# EAGLE design ONET1191P-breakout (EAGLE 9.4.1)
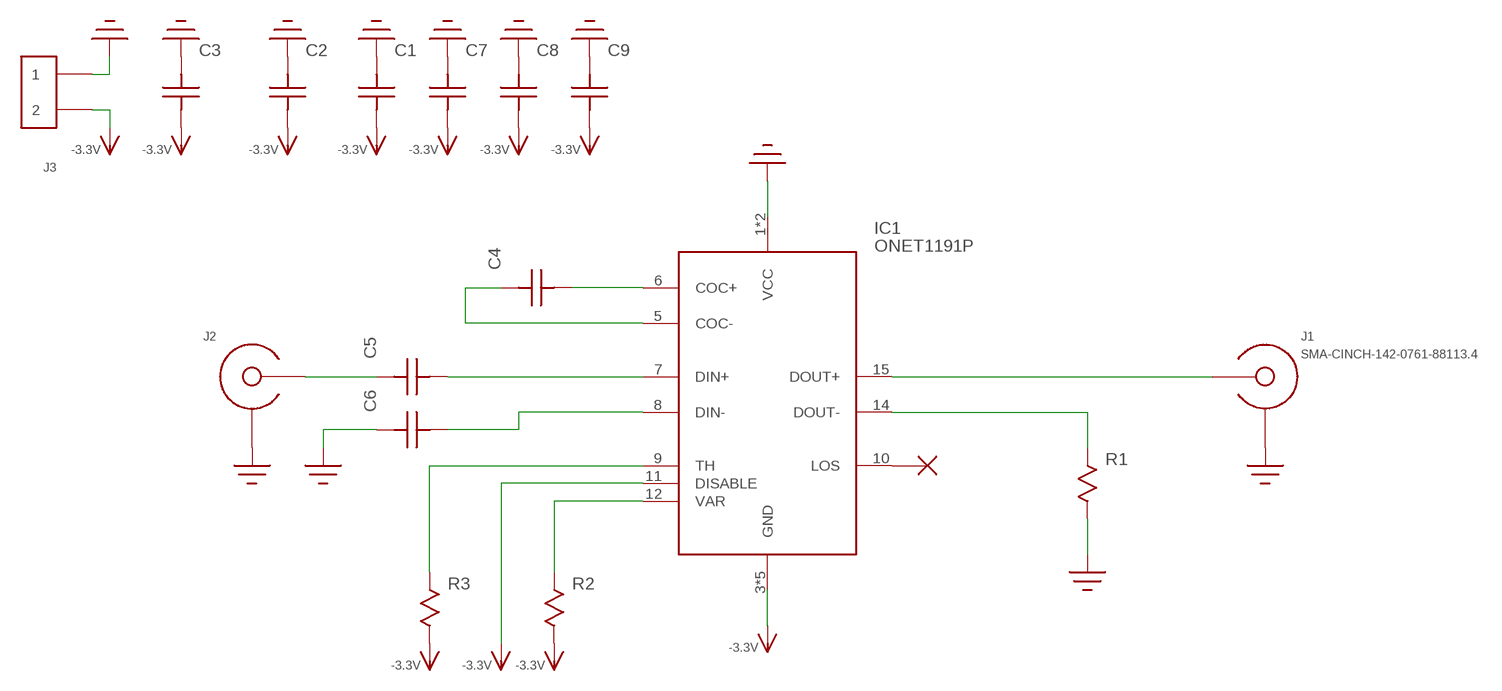
[diagram p0: schematic, sheet 1]

## Parts
C1  C0603  [C0603]
C2  C0603  [C0603]
C3  C1206  [1206]
C4  C  [C0402]
C5  C  [C0402]
C6  C  [C0402]
C7  C  [C0402]
C8  C  [C0402]
C9  C  [C0402]
IC1  ONET1191P  [TQFN16]
J1  SMA-CINCH-142-0761-88113.4  [SMA-CINCH-142-0761-881-13.4]
J2  SMA-EDGE-LAUNCH4L-4020-TAPER-FIXED  [SMA_EDGE_LAUNCH_4L_4020_TAPER_FIXED]
J3  HEADER_2PIN  [HEADER_2PIN]
R1  R0402  [0402]
R2  R0603  [R0603]
R3  R0603  [R0603]
U$8  NO_CONNECT  (no package)

## Nets
-3.3V: C1.P$1 C2.P$1 C3.P$1 C7.1 C8.1 C9.1 IC1.3(GND) IC1.4(GND) IC1.11(DISABLE) IC1.13(GND) IC1.16(GND) IC1.EP(GND) J3.2 R2.P$2 R3.P$2
GND: C1.P$2 C2.P$2 C3.P$2 C6.2 C7.2 C8.2 C9.2 IC1.1(VCC) IC1.2(VCC) J1.GND@1(SHIELD) J1.GND@2(SHIELD) J1.GND@3(SHIELD) J1.HOLE@1(SHIELD) J1.HOLE@2(SHIELD) J1.HOLE@3(SHIELD) J1.HOLE@4(SHIELD) J1.VIA@1(SHIELD) J1.VIA@2(SHIELD) J1.VIA@3(SHIELD) J1.VIA@4(SHIELD) J1.VIA@5(SHIELD) J1.VIA@6(SHIELD) J2.BOTTOM_GND(SHIELD) J2.GND@1(SHIELD) J2.GND@2(SHIELD) J2.GND@3(SHIELD) J2.GND@4(SHIELD) J2.GND@5(SHIELD) J2.GND@6(SHIELD) J2.GND@7(SHIELD) J2.GND@8(SHIELD) J2.GND@14(SHIELD) J2.GND@15(SHIELD) J2.GND@16(SHIELD) J2.GND@17(SHIELD) J2.GND_PAD1(SHIELD) J2.GND_PAD2(SHIELD) J2.P$1(SHIELD) J2.P$2(SHIELD) J3.1 R1.2
N$1: C4.1 IC1.6(COC+)
N$2: C4.2 IC1.5(COC-)
N$3: IC1.14(DOUT-) R1.1
N$4 [13.4-6]: IC1.15(DOUT+) J1.CENTER
N$5: IC1.12(VAR) R2.P$1
N$6: IC1.9(TH) R3.P$1
N$7: IC1.10(LOS) U$8.P$1
N$9 [13.4-6]: C5.2 J2.CENTER@1(CENTER) J2.P$3(CENTER)
N$10: C5.1 IC1.7(DIN+)
N$11: C6.1 IC1.8(DIN-)

## Library data of the parts
C1-C9 = yapo:C
IC1 = yapo:ONET1191P
J1 = yapo:SMA-CINCH-142-0761-881
J2 = yapo:SMA-EDGE-LAUNCH
J3 = yapo:HEADER_2PIN
R1-R3 = yapo:R
U$8 = yapo:NO_CONNECT

## Net classes
1 13.4-6: width 0.34 mm, clearance 0.152 mm

## Board
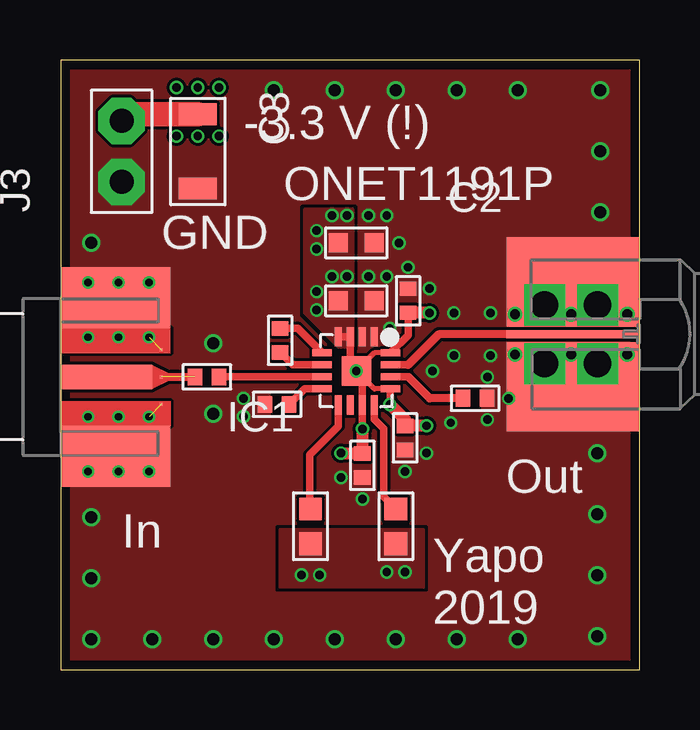
[diagram p1: board, top side]
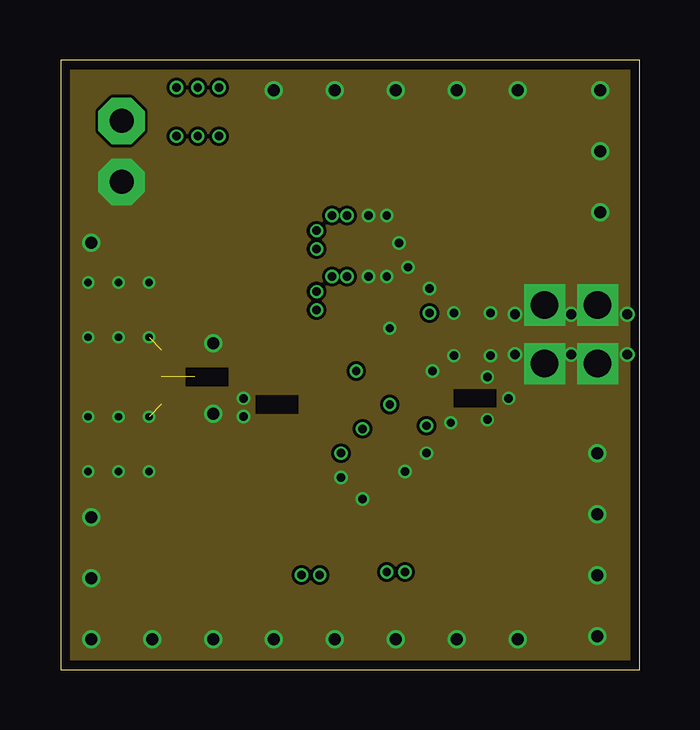
[diagram p2: board, inner layer Route2]
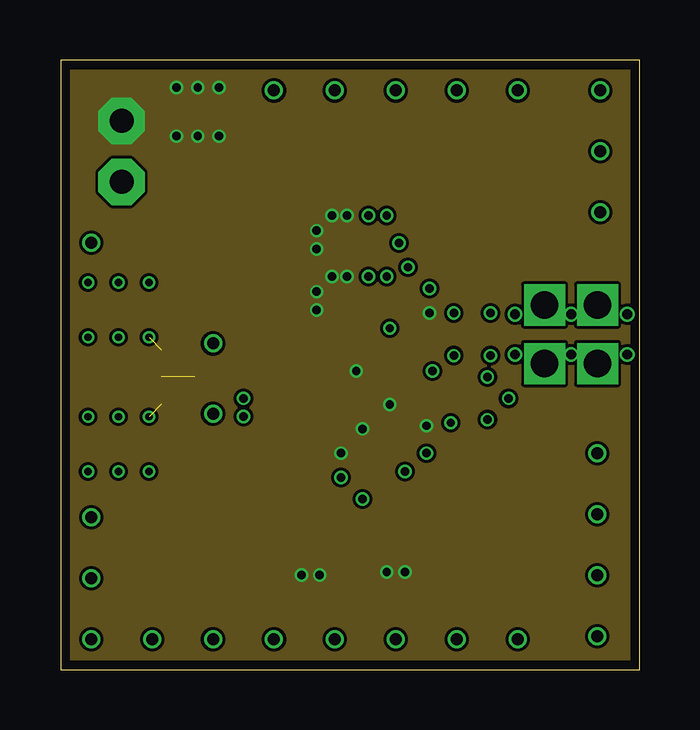
[diagram p3: board, inner layer Route15]
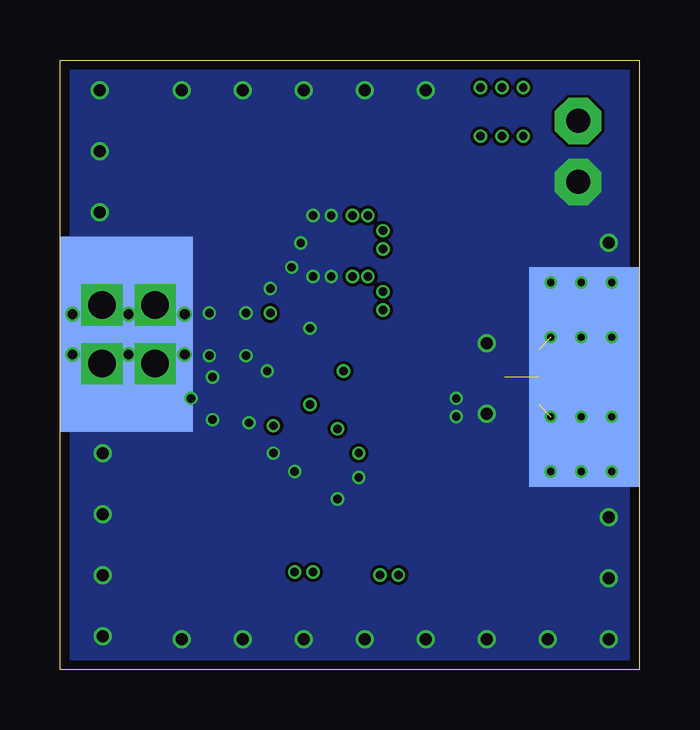
[diagram p4: board, bottom side, seen from below]

Size 24.13 x 25.4 mm. Coordinates in mm from the lower left corner, seen from the top.
Outline: 0,0 24.13,0 24.13,25.4 0,25.4 0,0
Copper layers (1*2*15*16): Top 0.035559375mm / dielectric 0.17018125mm / Route2 0.01778125mm / dielectric 47mil / Route15 0.01778125mm / dielectric 0.17018125mm / Bottom 0.035559375mm
Design rules "oshpark-4layer *": minimum track width 5mil, minimum drill 10mil, track to track 5mil, track to pad 5mil, pad to pad 5mil, via to via 5mil, smd to smd 5mil, copper to edge 15mil, drill to drill 6mil, minimum pad ring 4mil, minimum via ring 4mil, stop-mask expansion 2.5mil, vias tented up to drill 20mil, thermal gap 10mil

### Footprints (pad centres in the part's own frame; a part is rotated, then mirrored left to right if it is on the bottom)
C0603 = smd 0.8 x 0.8: P$1 -0.75,0; P$2 0.75,0
1206 = smd 0.9 x 1.6: P$1 -1.55,0; P$2 1.55,0
C0402 = smd 0.6 x 0.7: 1 -0.5,0; 2 0.5,0
TQFN16 = smd 0.3 x 0.8: 1 -0.75,-1.425; 2 -0.25,-1.425; 3 0.25,-1.425; 4 0.75,-1.425; 9 0.75,1.425; 10 0.25,1.425; 11 -0.25,1.425; 12 -0.75,1.425 | smd 0.8 x 0.3: 5 1.425,-0.75; 6 1.425,-0.25; 7 1.425,0.25; 8 1.425,0.75; 13 -1.425,0.75; 14 -1.425,0.25; 15 -1.425,-0.25; 16 -1.425,-0.75 | smd 1.23 x 1.23: EP 0,0
SMA-CINCH-142-0761-881-13.4 = smd 0.34 x 5.537: CENTER 0,-2.794 | smd 3.724 x 5.537: GND@1 -2.184,-2.769; GND@2 2.184,-2.769 | smd 8.128 x 5.537 bottom: GND@3 0,-2.769 | drill 1.143 pad 1.422 square: HOLE@1 -1.219,-3.962; HOLE@2 1.219,-3.962; HOLE@3 1.219,-1.753; HOLE@4 -1.219,-1.753 | drill 0.406 pad 0.61: VIA@1 -0.838,-5.194; VIA@2 0.838,-5.194; VIA@3 0.838,-2.857; VIA@4 0.838,-0.521; VIA@5 -0.838,-0.521; VIA@6 -0.838,-2.857
SMA_EDGE_LAUNCH_4L_4020_TAPER_FIXED = smd 4.572 x 9.144 bottom: BOTTOM_GND 2.286,0 | smd 3.81 x 1.016: CENTER@1 1.905,0 | drill 0.3: GND@1 1.143,3.937; GND@2 3.683,3.937; GND@3 1.143,1.651; GND@4 3.683,1.651; GND@5 1.143,-1.651; GND@6 3.683,-1.651; GND@7 1.143,-3.937; GND@8 3.683,-3.937; GND@14 2.413,3.937; GND@15 2.413,-3.937; GND@16 2.413,-1.651; GND@17 2.413,1.651 | smd 4.572 x 2.54: GND_PAD1 2.286,3.302; GND_PAD2 2.286,-3.302 | smd 0.127 x 0.127: P$1 4.191,1.143; P$2 4.191,-1.143; P$3 4.191,0
HEADER_2PIN = drill 1 pad 1.93 octagon: 1 -1.27,0; 2 1.27,0
0402 = smd 0.6 x 0.7: 1 -0.5,0; 2 0.5,0
R0603 = smd 0.95 x 0.95: P$1 -0.725,0; P$2 0.725,0

### Placement (x,y rotation side)
C1  12.32,15.37 0 top
C2  12.32,17.78 0 top
C3  5.71,21.59 270 top
C4  9.14,13.72 90 top
C5  6.1,12.19 180 top
C6  9.02,11.05 180 top
C7  14.35,9.65 270 top
C8  14.48,15.37 90 top
C9  12.57,8.51 270 top
IC1  12.32,12.45 180 top
J1  24.13,13.97 270 top
J2  0,12.19 0 top
J3  2.54,21.59 90 top
R1  17.27,11.3 0 top
R2  13.97,5.97 270 top
R3  10.41,5.97 270 top

### Tracks (layer width: path | path; a pad name or v marks a point on that pad's centre or on a via)
-3.3V  (via drill 0.35)
  Top 0.203: IC1.16 13.07,13.2 IC1.EP | IC1.13 13.07,11.7 12.57,12.2
  Top 0.305: v12.57,10.03 v12.57,10.04 IC1.11 12.57,12.2 IC1.EP 12.07,12.7 IC1.3 IC1.4 | v13.72,11.05 13.74,11.08 IC1.13 | IC1.16 14.48,13.93 C8.1
  Top 0.508: v12.57,10.03 C9.1 v11.68,9.02 | v13.72,11.05 14.35,10.41 C7.1 v15.23,10.15 v15.24,10.16 | v15.37,14.86 C8.1
  Top 1.016: J3.2 2.54,23.14 C3.P$1
  other vias: 12.32,12.45 10.03,3.94 10.79,3.94 13.59,4.06 14.35,4.06 10.67,15.75 10.67,14.99 11.3,16.38 11.94,16.38 11.3,18.92 11.94,18.92 10.67,18.29 10.67,17.53 5.71,22.23 6.6,22.23 4.83,22.23 5.71,24.26 6.6,24.26 4.83,24.26
  pour Top (no thermals): 12.19,13.46 12.19,19.18 10.16,19.18 10.16,14.86 11.56,13.46
  pour Route15 (no thermals): 0,0 0,25.4 24.13,25.4 24.13,0
  pour Top (no thermals): 9.14,5.84 15.11,5.84 15.11,3.43 9.14,3.43
GND  (via drill 0.35, 0.5)  (2 unrouted)
  other vias: 7.62,11.3 7.62,10.54 17.78,12.19 17.78,10.41 18.67,11.3 14.35,8.26 15.24,9.02 12.57,7.11 11.68,8 13.72,14.22 12.83,16.38 13.59,16.38 14.48,16.76 15.37,15.88 17.91,14.86 16.38,14.86 16.38,13.08 17.91,13.08 15.49,12.45 13.59,18.92 12.83,18.92 14.1,17.78 1.27,1.27 6.35,1.27 1.27,6.35 11.43,1.27 16.51,1.27 22.35,1.4 3.81,1.27 8.89,1.27 13.97,1.27 19.05,1.27 1.27,3.81 22.35,3.94 22.35,6.48 22.35,9.02 22.48,24.13 22.48,21.59 22.48,19.05 19.05,24.13 16.51,24.13 13.97,24.13 11.43,24.13 8.89,24.13 1.27,17.78 6.35,13.59 6.35,10.67 16.26,10.29
  cutout Top: 5.08,12.7 7.11,12.7 7.11,11.68 5.08,11.68
  cutout Top: 5.08,12.7 7.11,12.7 7.11,11.68 5.08,11.68
  cutout Top: 8.76,11.56 10.03,11.56 10.03,10.54 8.76,10.54
  pour Top (rank 2, no thermals): 0,0 0,25.4 24.13,25.4 24.13,0
  pour Route2 (no thermals): 0,0 0,25.4 24.13,25.4 24.13,0
  pour Bottom (no thermals): 0,0 0,25.4 24.13,25.4 24.13,0
  cutout Top: 16.26,11.81 17.53,11.81 17.53,10.79 16.26,10.79
  cutout Route2 (no thermals): 5.21,12.57 6.99,12.57 6.99,11.81 5.21,11.81
  cutout Route2 (no thermals): 8.13,11.43 9.91,11.43 9.91,10.67 8.13,10.67
  cutout Route2 (no thermals): 16.38,11.68 18.16,11.68 18.16,10.92 16.38,10.92
N$1
  Top 0.305: IC1.6 9.66,12.7 C4.1
N$2
  Top 0.305: IC1.5 9.87,14.22 C4.2
N$3
  Top 0.305: 14.48,12.19 IC1.14
  Top 0.34: R1.1 15.38,11.3 14.49,12.19 14.48,12.19
N$4
  Top 0.305: 14.48,12.7 IC1.15
  Top 0.34: J1.CENTER 15.75,13.97 14.48,12.7
N$5
  Top 0.305: IC1.12 13.07,10.43 13.46,10.03 13.46,7.2 R2.P$1
N$6
  Top 0.305: IC1.9 11.57,10.13 10.38,8.94 10.38,6.73 R3.P$1
N$9  (1 unrouted)
  Top 0.34: J2.CENTER@1 C5.2
N$10
  Top 0.305: IC1.7 C5.1
N$11
  Top 0.305: C6.1 10.16,11.7 IC1.8

### Text on the board
tPlace: -3.3 V (!) | ONET1191P | GND | Out | In | Yapo | 2019